# Altium project 200221 UCM R0.PrjPcb
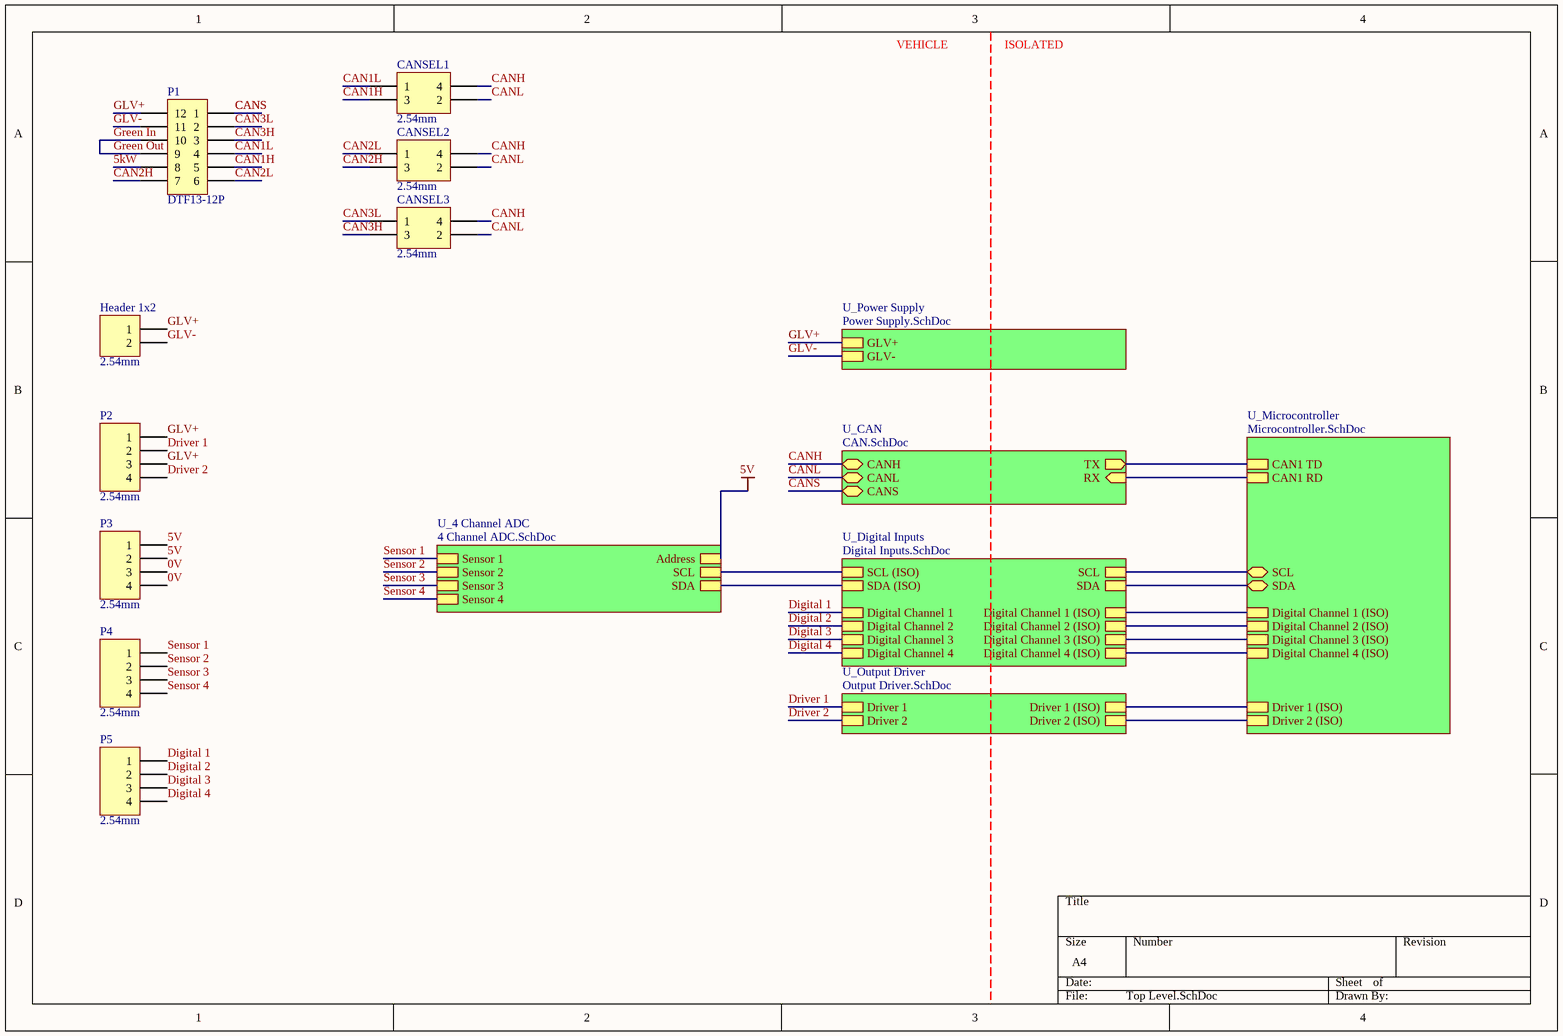
[diagram p0: Top Level.SchDoc]
8 sheets, 143 parts. Net scope: hierarchical (ports join the sheet entries above them; power ports are global).
Board file: PCB.PcbDoc
Sheets:
  Top Level.SchDoc
    U_4 Channel ADC = 4 Channel ADC.SchDoc
      U_Input Filter = Input Filter.SchDoc
      U_Input Filter = Input Filter.SchDoc
      U_Input Filter = Input Filter.SchDoc
      U_Input Filter = Input Filter.SchDoc
    U_CAN = CAN.SchDoc
    U_Output Driver = Output Driver.SchDoc
    U_Power Supply = Power Supply.SchDoc
    U_Microcontroller = Microcontroller.SchDoc
    U_Digital Inputs = Digital Inputs.SchDoc

## Sheet Top Level.SchDoc
size A4

### Parts
CANSEL1  2.54mm  [TH 2.54mm Header 2x2]
CANSEL2  2.54mm  [TH 2.54mm Header 2x2]
CANSEL3  2.54mm  [TH 2.54mm Header 2x2]
Header_1x2  2.54mm  [TH 5.08mm Header 1x2]
P1  DTF13-12P  [DTF13-12P]
P2  2.54mm  [TH 5.08mm Header 1x4]
P3  2.54mm  [TH 5.08mm Header 1x4]
P4  2.54mm  [TH 5.08mm Header 1x4]
P5  2.54mm  [TH 5.08mm Header 1x4]

### Sub-sheets
U_4 Channel ADC = 4 Channel ADC.SchDoc: Address, SCL, SDA, Sensor 1, Sensor 2, Sensor 3, Sensor 4
U_CAN = CAN.SchDoc: CANS (bidir), RX (in), CANL (bidir), CANH (bidir), TX (out)
U_Digital Inputs = Digital Inputs.SchDoc: Digital Channel 1, Digital Channel 2, Digital Channel 3, Digital Channel 4, Digital Channel 1 (ISO), Digital Channel 2 (ISO), Digital Channel 3 (ISO), Digital Channel 4 (ISO), SCL (ISO), SDA (ISO), SCL, SDA
U_Microcontroller = Microcontroller.SchDoc: CAN1 RD, CAN1 TD, SDA (bidir), SCL (bidir), Driver 1 (ISO), Driver 2 (ISO), Digital Channel 1 (ISO), Digital Channel 2 (ISO), Digital Channel 3 (ISO), Digital Channel 4 (ISO)
U_Output Driver = Output Driver.SchDoc: Driver 1, Driver 2, Driver 1 (ISO), Driver 2 (ISO)
U_Power Supply = Power Supply.SchDoc: GLV+, GLV-

### Nets
5V: P3.1 P3.2 ; sheet U_4 Channel ADC/Address
0V: P3.3 P3.4
5kW: P1.8
CAN1H: CANSEL1.3 P1.5
CAN1L: CANSEL1.1 P1.4
CAN2H: CANSEL2.3 P1.7
CAN2L: CANSEL2.1 P1.6
CAN3H: CANSEL3.3 P1.3
CAN3L: CANSEL3.1 P1.2
CANH: CANSEL1.4 CANSEL2.4 CANSEL3.4 ; sheet U_CAN/CANH
CANL: CANSEL1.2 CANSEL2.2 CANSEL3.2 ; sheet U_CAN/CANL
CANS: P1.1 ; sheet U_CAN/CANS
Digital 1: P5.1 ; sheet U_Digital Inputs/Digital Channel 1
Digital 2: P5.2 ; sheet U_Digital Inputs/Digital Channel 2
Digital 3: P5.3 ; sheet U_Digital Inputs/Digital Channel 3
Digital 4: P5.4 ; sheet U_Digital Inputs/Digital Channel 4
Driver 1: P2.2 ; sheet U_Output Driver/Driver 1
Driver 2: P2.4 ; sheet U_Output Driver/Driver 2
GLV+: Header_1x2.1 P1.12 P2.1 P2.3 ; sheet U_Power Supply/GLV+
GLV-: Header_1x2.2 P1.11 ; sheet U_Power Supply/GLV-
Green In: P1.9 P1.10  [also labelled Green Out]
Sensor 1: P4.1 ; sheet U_4 Channel ADC/Sensor 1
Sensor 2: P4.2 ; sheet U_4 Channel ADC/Sensor 2
Sensor 3: P4.3 ; sheet U_4 Channel ADC/Sensor 3
Sensor 4: P4.4 ; sheet U_4 Channel ADC/Sensor 4
NetCAN_RX_TP1_1: sheet U_CAN/RX, sheet U_Microcontroller/CAN1 RD
NetCAN_TX_TP1_1: sheet U_CAN/TX, sheet U_Microcontroller/CAN1 TD
NetR19_1: sheet U_Microcontroller/SCL, sheet U_Digital Inputs/SCL
NetR20_1: sheet U_Microcontroller/SDA, sheet U_Digital Inputs/SDA
NetR24_2: sheet U_Output Driver/Driver 1 (ISO), sheet U_Microcontroller/Driver 1 (ISO)
NetR27_2: sheet U_Output Driver/Driver 2 (ISO), sheet U_Microcontroller/Driver 2 (ISO)
NetR33_1: sheet U_4 Channel ADC/SCL, sheet U_Digital Inputs/SCL (ISO)
NetR34_1: sheet U_4 Channel ADC/SDA, sheet U_Digital Inputs/SDA (ISO)
NetU5_11: sheet U_Microcontroller/Digital Channel 4 (ISO), sheet U_Digital Inputs/Digital Channel 4 (ISO)
NetU5_12: sheet U_Microcontroller/Digital Channel 3 (ISO), sheet U_Digital Inputs/Digital Channel 3 (ISO)
NetU5_13: sheet U_Microcontroller/Digital Channel 2 (ISO), sheet U_Digital Inputs/Digital Channel 2 (ISO)
NetU5_14: sheet U_Microcontroller/Digital Channel 1 (ISO), sheet U_Digital Inputs/Digital Channel 1 (ISO)

### Notes on the sheet
- VEHICLE
- ISOLATED

### Library data of the parts
CANSEL1-CANSEL3 = TH 2.54mm Header 2x2: Positions: 4; Angle: 0; Flange: No; Contact: NA; Part Number: TH 2.54mm Header 2x2; Pitch: 2.54mm; Row Spacing: 2.54mm
Header_1x2 = TH 5.08mm Header 1x2: Positions: 2; Row Spacing: 5.08mm; Angle: 0; Flange: No; Contact: NA; Part Number: TH 5.08mm Header 1x2; Pitch: 2.54mm
P1 = DTF13-12P[[/\]]DTF13-12P: Positions: 12; Pitch: 4.45mm; Angle: 90; Flange: No; Contact: Copper Alloy; Part Number: DTF13-12P; Row Spacing: 4.45mm; Digikey Part Number: 1734-1861-ND; Digikey Link: https://www.digikey.com.au/product-detail/en/te-connectivity-deutsch-connectors/DTF13-12PA/1734-1861-ND/9744662
P2-P5 = TH 5.08mm Header 1x4: Positions: 4; Row Spacing: 5.08mm; Angle: 0; Flange: No; Contact: NA; Part Number: TH 5.08mm Header 1x4; Pitch: 2.54mm

## Sheet 4 Channel ADC.SchDoc
size A4
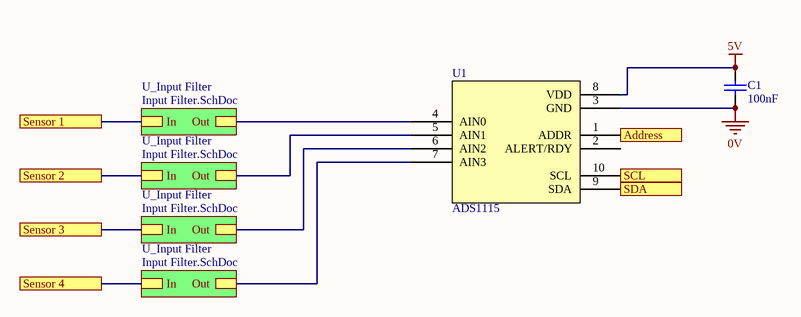
[diagram p1: 4 Channel ADC.SchDoc]

### Parts
C1  100nF  [0805]
U1  ADS1115  [TI 10-VSSOP]

### Sub-sheets
U_Input Filter = Input Filter.SchDoc: In, Out
U_Input Filter = Input Filter.SchDoc: In, Out
U_Input Filter = Input Filter.SchDoc: In, Out
U_Input Filter = Input Filter.SchDoc: In, Out

### Ports
Address, SCL, SDA, Sensor 1, Sensor 2, Sensor 3, Sensor 4

### Nets
0V: C1.1 U1.3(GND)
5V: C1.2 U1.1(ADDR) U1.8(VDD) ; port Address
Sensor 1: port Sensor 1, sheet U_Input Filter/In
Sensor 2: port Sensor 2, sheet U_Input Filter/In
Sensor 3: port Sensor 3, sheet U_Input Filter/In
Sensor 4: port Sensor 4, sheet U_Input Filter/In
NetC17_U_Input_Filter1_2: U1.7(AIN3) ; sheet U_Input Filter/Out
NetC17_U_Input_Filter2_2: U1.6(AIN2) ; sheet U_Input Filter/Out
NetC17_U_Input_Filter3_2: U1.5(AIN1) ; sheet U_Input Filter/Out
NetC17_U_Input_Filter4_2: U1.4(AIN0) ; sheet U_Input Filter/Out
NetR33_1: U1.10(SCL) ; port SCL
NetR34_1: U1.9(SDA) ; port SDA

Not connected (* = marked no-connect by the designer): U1 2(ALERT/RDY)

### Library data of the parts
C1 = GCM21BR71E104KA37L: Manufacturer: muRata; Tolerance: 10%; Material: X7R; Rated Voltage: 25V; Part Number: GCM21BR71E104KA37L; Value: 100nF
U1 = ADS1115: 16 Bit Analog to Digital Converter 2, 4 Input 1 Sigma-Delta 10-VSSOP; Manufacturer: Texas Instruments; Part Number: ADS1115; Digikey Part Number: 296-38849-1-ND; Digikey Link: https://www.digikey.com/product-detail/en/texas-instruments/ADS1115IDGSR/296-38849-1-ND/5142969

## Sheet Input Filter.SchDoc
size A4
Used 4 times, as channels U_4 Channel ADC/U_Input Filter, U_4 Channel ADC/U_Input Filter, U_4 Channel ADC/U_Input Filter, U_4 Channel ADC/U_Input Filter. Parts and nets are listed once, with the designators drawn on the sheet.
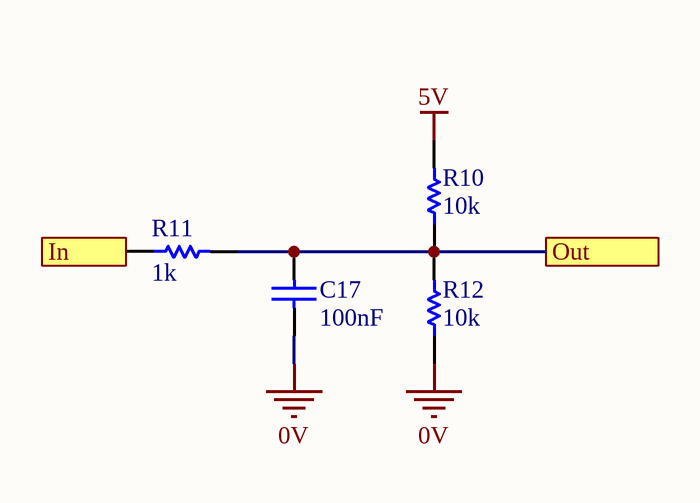
[diagram p2: Input Filter.SchDoc]

### Parts
C17  100nF  [0805]
R10  10k  [0805]
R11  1k  [0805]
R12  10k  [0805]

### Ports
In, Out

### Nets
0V: C17.1 R12.1
5V: R10.2
In: R11.1 ; port In
Out: C17.2 R10.1 R11.2 R12.2 ; port Out

### Channels
U_4 Channel ADC/U_Input Filter: designators end in _U_Input_Filter4; ports In=Sensor 1 Out=NetC17_U_Input_Filter4_2
U_4 Channel ADC/U_Input Filter: designators end in _U_Input_Filter3; ports In=Sensor 2 Out=NetC17_U_Input_Filter3_2
U_4 Channel ADC/U_Input Filter: designators end in _U_Input_Filter2; ports In=Sensor 3 Out=NetC17_U_Input_Filter2_2
U_4 Channel ADC/U_Input Filter: designators end in _U_Input_Filter1; ports In=Sensor 4 Out=NetC17_U_Input_Filter1_2

### Library data of the parts
C17 = GCM21BR71E104KA37L: as C1 on sheet 4 Channel ADC; Part Number: GCM21BR71E104KA37L; Value: 100nF
R10 R12 = RC0805FR0710KL: Manufacturer: YAGEO; Tolerance: 0.01; Rated Voltage: 0.125W; Part Number: RC0805FR0710KL; Value: 10k; Material: FR-07
R11 = RC0805FR071KL: Manufacturer: YAGEO; Tolerance: 0.01; Rated Voltage: 0.125W; Part Number: RC0805FR071KL; Value: 1k; Material: FR-07

## Sheet CAN.SchDoc
size A4
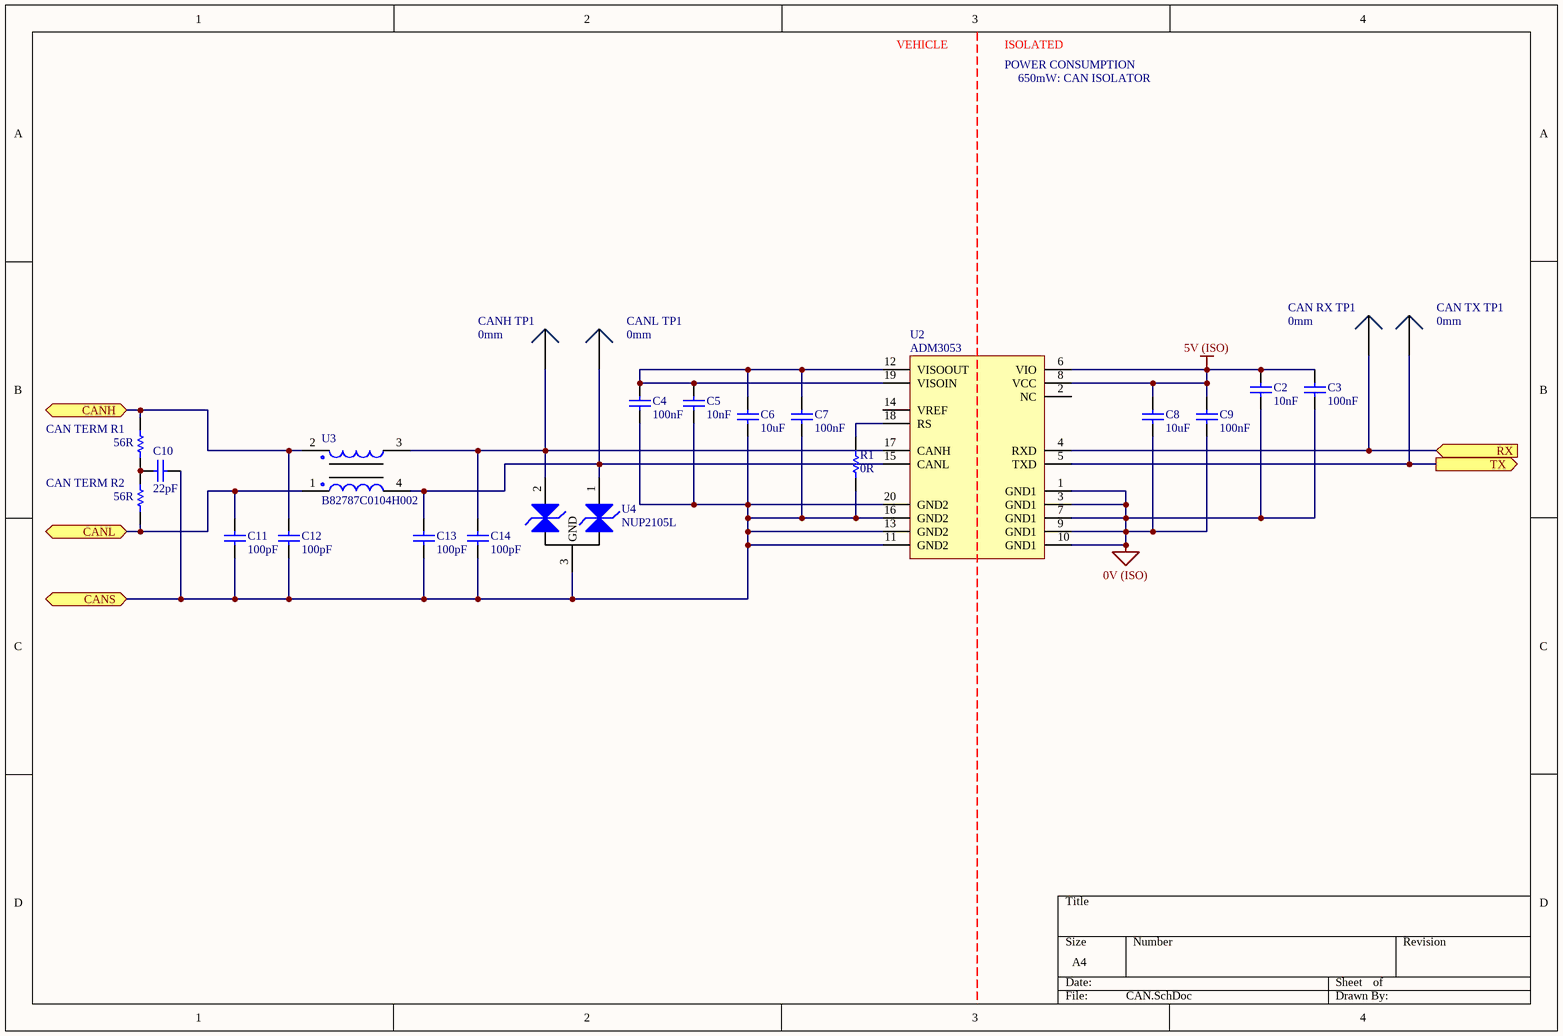
[diagram p3: CAN.SchDoc]

### Parts
C2  10nF  [1206]
C3  100nF  [0805]
C4  100nF  [0805]
C5  10nF  [1206]
C6  10uF  [0805]
C7  100nF  [0805]
C8  10uF  [0805]
C9  100nF  [0805]
C10  22pF  [0805]
C11  100pF  [0805]
C12  100pF  [0805]
C13  100pF  [0805]
C14  100pF  [0805]
CAN_RX_TP1  0mm  [SMD Test Point]
CAN_TERM_R1  56R  [0805]
CAN_TERM_R2  56R  [0805]
CAN_TX_TP1  0mm  [SMD Test Point]
CANH_TP1  0mm  [SMD Test Point]
CANL_TP1  0mm  [SMD Test Point]
R1  0R  [0805]
U2  ADM3053  [AD SOIC-W 20]
U3  B82787C0104H002  [TDK 4-PC Pad]
U4  NUP2105L  [ON SOT-23]

### Ports
CANH (bidir), CANL (bidir), CANS (bidir), RX (in), TX (out)

### Nets
0V (ISO): C2.1 C3.1 C8.1 C9.1 U2.1(GND1) U2.3(GND1) U2.7(GND1) U2.9(GND1) U2.10(GND1)
5V (ISO): C2.2 C3.2 C8.2 C9.2 U2.6(VIO) U2.8(VCC)
CANH: C12.2 CAN_TERM_R1.2 U3.2 ; port CANH
CANL: C11.2 CAN_TERM_R2.1 U3.1 ; port CANL
CANS: C4.1 C5.1 C6.1 C7.1 C10.1 C11.1 C12.1 C13.1 C14.1 R1.1 U2.11(GND2) U2.13(GND2) U2.16(GND2) U2.20(GND2) U4.3(GND) ; port CANS
NetC4_2: C4.2 C5.2 C6.2 C7.2 U2.12(VISOOUT) U2.19(VISOIN)
NetC10_2: C10.2 CAN_TERM_R1.1 CAN_TERM_R2.2
NetC13_2: C13.2 CANL_TP1.1 U2.15(CANL) U3.4 U4.1(CAN_H)
NetC14_2: C14.2 CANH_TP1.1 U2.17(CANH) U3.3 U4.2(CAN_L)
NetCAN_RX_TP1_1: CAN_RX_TP1.1 U2.4(RXD) ; port RX
NetCAN_TX_TP1_1: CAN_TX_TP1.1 U2.5(TXD) ; port TX
NetR1_2: R1.2 U2.18(RS)

Not connected (* = marked no-connect by the designer): U2 2(NC) 14(VREF)

### Notes on the sheet
- VEHICLE
- ISOLATED
- POWER CONSUMPTION
- 650mW: CAN ISOLATOR

### Library data of the parts
C2 C5 = GCM3195C2A103JA16D: Manufacturer: muRata; Tolerance: 5%; Material: Ceramic; Rated Voltage: 100V; Part Number: GCM3195C2A103JA16D; Value: 10nF; Digikey Part Number: 490-4978-2-ND
C3 C4 C7 C9 = GCM21BR71E104KA37L: as C1 on sheet 4 Channel ADC; Part Number: GCM21BR71E104KA37L; Value: 100nF
C6 C8 = GRM21BR6YA106KE43L: Manufacturer: muRata; Tolerance: 10%; Material: X5R; Rated Voltage: 50V; Part Number: GRM21BR6YA106KE43L; Value: 10uF; Digikey Part Number: 490-10514-6-ND
C10 = GCM21B5C1H220JA37L: Manufacturer: muRata; Tolerance: 5%; Material: C0G; Rated Voltage: 50V; Part Number: GCM21B5C1H220JA37L; Value: 22pF
C11-C14 = GCM21B5C1H101JA37L: Manufacturer: muRata; Tolerance: 5%; Material: C0G; Rated Voltage: 50V; Part Number: GCM21B5C1H101JA37L; Value: 100pF
CAN_RX_TP1 CAN_TX_TP1 CANH_TP1 CANL_TP1 = SMD Test Point: Positions: 1; Row Spacing: 0; Flange: No; Contact: NA; Part Number: SMD Test Point; Pitch: 0mm; Angle: 0
CAN_TERM_R1 CAN_TERM_R2 = RC0805FR0756RL: Manufacturer: YAGEO; Tolerance: 0.01; Rated Voltage: 0.125W; Part Number: RC0805FR0756RL; Value: 56R; Material: FR-07
R1 = RC0805FR070RL: Manufacturer: YAGEO; Tolerance: 0.01; Rated Voltage: 0.125W; Part Number: RC0805FR070RL; Value: 0R; Material: FR-07
U2 = ADM3053: Isolated CAN Transceiver; Manufacturer: Analogue Devices; Part Number: ADM3053; Digikey Part Number: ADM3053BRWZ-ND; Digikey Link: https://www.digikey.com/product-detail/en/analog-devices-inc/ADM3053BRWZ/ADM3053BRWZ-ND/2709332
U3 = B82787C0104H002: 100µH @ 100kHz 2 Line Common Mode Choke Surface Mount 5.8 kOhms @ 10MHz 150mA DCR 2Ohm; Manufacturer: EPCOS (TDK); Part Number: B82787C0104H002; Inductance: 100µH @ 100kHz; Impedence: 5.8 kOhms @ 10MHz; Material: Wirewound; Rated Current: 150mA; Digikey Part Number: 495-4598-1-ND; Digikey Link: https://www.digikey.com/product-detail/en/epcos-tdk/B82787C0104H002/495-4598-2-ND/3680998
U4 = NUP2105L: Dual Line CAN Bus Protector; Manufacturer: ON Semiconductor; Part Number: NUP2105L; Digikey Part Number: NUP2105LT1GOSCT-ND; Digikey Link: https://www.digikey.com/product-detail/en/on-semiconductor/NUP2105LT1G/NUP2105LT1GOSCT-ND/1485001

## Sheet Output Driver.SchDoc
size A4
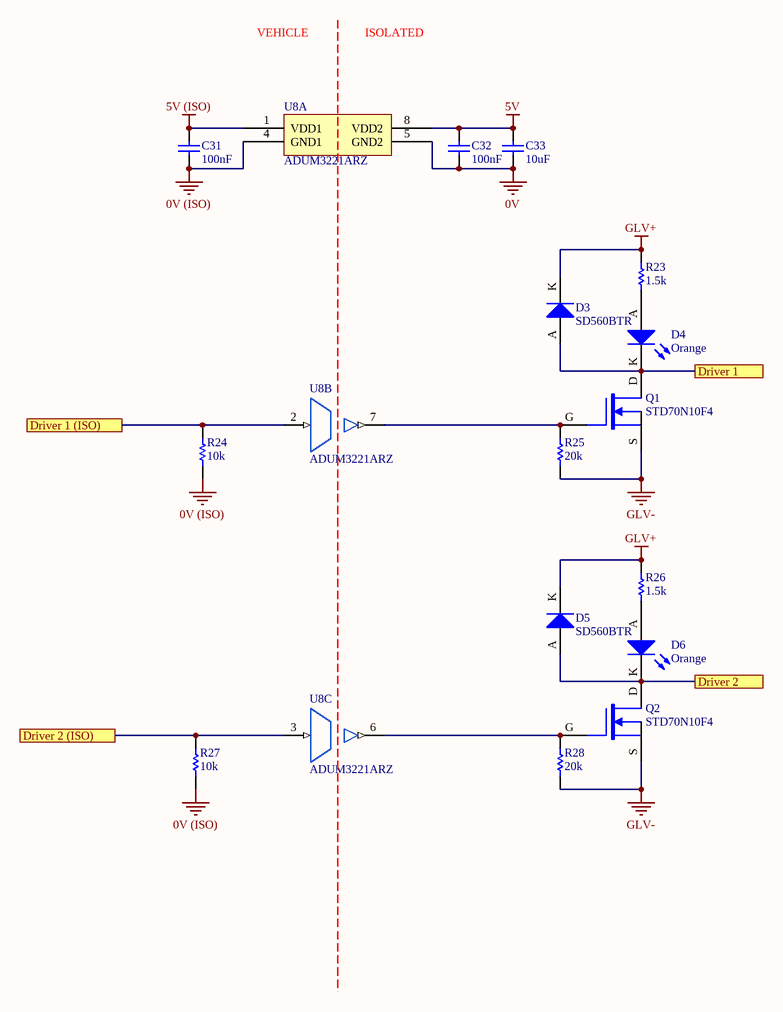
[diagram p4: Output Driver.SchDoc]

### Parts
C31  100nF  [0805]
C32  100nF  [0805]
C33  10uF  [0805]
D3  SD560BTR  [SMB Diode]
D4  Orange  [0805 LED]
D5  SD560BTR  [SMB Diode]
D6  Orange  [0805 LED]
Q1  STD70N10F4  [SOT-343_N]
Q2  STD70N10F4  [SOT-343_N]
R23  1.5k  [0805]
R24  10k  [0805]
R25  20k  [0805]
R26  1.5k  [0805]
R27  10k  [0805]
R28  20k  [0805]
U8  ADUM3221ARZ  [AD 8-SOIC]  (parts A,B,C of 3)

### Ports
Driver 1, Driver 1 (ISO), Driver 2, Driver 2 (ISO)

### Nets
0V: C32.1 C33.1 U8.5(GND2)
0V (ISO): C31.1 R24.1 R27.1 U8.4(GND1)
5V: C32.2 C33.2 U8.8(VDD2)
5V (ISO): C31.2 U8.1(VDD1)
GLV+: D3.K D5.K R23.2 R26.2
GLV-: Q1.S Q2.S R25.1 R28.1
Driver 1: D3.A D4.K Q1.D ; port Driver 1
Driver 2: D5.A D6.K Q2.D ; port Driver 2
NetD4_A: D4.A R23.1
NetD6_A: D6.A R26.1
NetQ1_G: Q1.G R25.2 U8.7(VOA)
NetQ2_G: Q2.G R28.2 U8.6(VOA)
NetR24_2: R24.2 U8.2(VIA) ; port Driver 1 (ISO)
NetR27_2: R27.2 U8.3(VIA) ; port Driver 2 (ISO)

### Notes on the sheet
- VEHICLE
- ISOLATED

### Library data of the parts
C31 C32 = GCM21BR71E104KA37L: as C1 on sheet 4 Channel ADC; Part Number: GCM21BR71E104KA37L; Value: 100nF
C33 = GRM21BR6YA106KE43L: as C6 on sheet CAN; Part Number: GRM21BR6YA106KE43L; Value: 10uF; Digikey Part Number: 490-10514-6-ND
D3 D5 = SD560BTR: 1.2V_F 600V 5A SMB; Manufacturer: SMC Diode Solutions; Part Number: SD560BTR; Digikey Part Number: 1655-1530-2-ND; Digikey Link: https://www.digikey.com/product-detail/en/smc-diode-solutions/SD560BTR/1655-1530-2-ND/6022620
D4 D6 = SML-211DTT86: Orange LED Indication - Discrete 1.75V 0805 (2012 Metric); Manufacturer: ROHM Semiconductor; Part Number: SML-211DTT86; Colour: Orange; Digikey Part Number: 511-1291-1-ND; Digikey Link: https://www.digikey.com/product-detail/en/rohm-semiconductor/SML-211DTT86/511-1291-1-ND/637104
Q1 Q2 = STD70N10F4: N-Channel 100V 60A (Tc) 125W (Tc) Surface Mount DPAK; Manufacturer: STMicroelectronics; Published: 24-Mar-1999; LatestRevisionDate: 29-May-2009; LatestRevisionNote: IPC-7351 Footprint Added.; PackageVersion: Sep-2000; PackageReference: SOT-343; Publisher: Altium Limited; PackageDescription: 4-Pin SOT-343 Package 1.3 mm Pitch, 2.1 mm Lead Span; Part Number: STD70N10F4; Digikey Part Number: 497-8806-2-ND; Digikey Link: https://www.digikey.com/product-detail/en/stmicroelectronics/STD70N10F4/497-8806-2-ND/2035599
R23 R26 = RC0805FR071K5L: Manufacturer: YAGEO; Tolerance: 0.01; Rated Voltage: 0.125W; Part Number: RC0805FR071K5L; Value: 1.5k; Material: FR-07
R24 R27 = RC0805FR0710KL: as R10 on sheet Input Filter; Part Number: RC0805FR0710KL; Value: 10k; Material: FR-07
R25 R28 = RC0805FR0720KL: Manufacturer: YAGEO; Tolerance: 0.01; Rated Voltage: 0.125W; Part Number: RC0805FR0720KL; Value: 20k; Material: FR-07
U8 = ADUM3221ARZ: 4A Gate Driver Magnetic Coupling 2500Vrms 2 Channel 8-SOIC; Manufacturer: Analog Devices; Part Number: ADUM3221ARZ; Digikey Part Number: ADUM3221ARZ-ND; Digikey Link: https://www.digikey.com/product-detail/en/analog-devices-inc/ADUM3221ARZ/ADUM3221ARZ-ND/2616333

## Sheet Power Supply.SchDoc
size A4
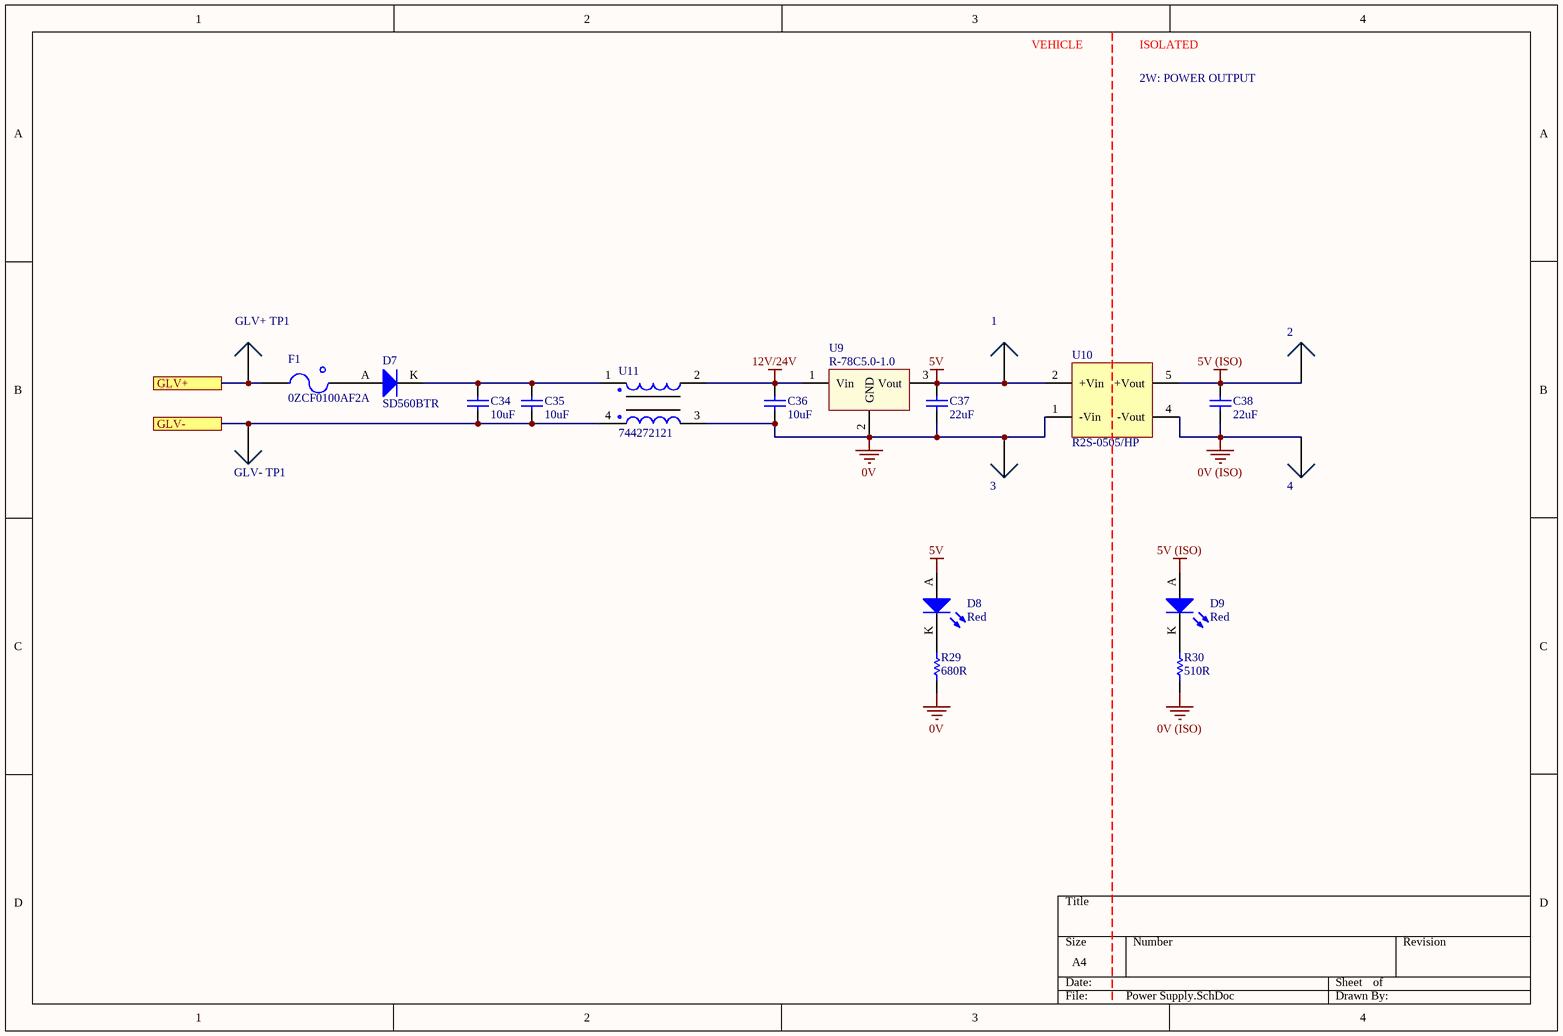
[diagram p5: Power Supply.SchDoc]

### Parts
1  0mm  [SMD Test Point]  (value not drawn)
2  0mm  [SMD Test Point]  (value not drawn)
3  0mm  [SMD Test Point]  (value not drawn)
4  0mm  [SMD Test Point]  (value not drawn)
C34  10uF  [0805]
C35  10uF  [0805]
C36  10uF  [0805]
C37  22uF  [1206]
C38  22uF  [1206]
D7  SD560BTR  [SMB Diode]
D8  Red  [0805 LED]
D9  Red  [0805 LED]
F1  0ZCF0100AF2A  [2920]
GLV+_TP1  0mm  [SMD Test Point]  (value not drawn)
GLV-_TP1  0mm  [SMD Test Point]  (value not drawn)
R29  680R  [0805]
R30  510R  [0805]
U9  R-78C5.0-1.0  [RECOM 3-SIP]
U10  R2S-0505/HP  [RECOM 8-SMD (5 Pin)]
U11  744272121  [INDC3216]

### Ports
GLV+, GLV-

### Nets
0V: 3.1 C36.1 C37.1 R29.1 U9.2(GND) U10.1(-Vin) U11.3
0V (ISO): 4.1 C38.1 R30.1 U10.4(-Vout)
5V: 1.1 C37.2 D8.A U9.3(Vout) U10.2(+Vin)
5V (ISO): 2.1 C38.2 D9.A U10.5(+Vout)
12V/24V: C36.2 U9.1(Vin) U11.2
GLV+: F1.1 GLV+_TP1.1 ; port GLV+
GLV-: C34.1 C35.1 GLV-_TP1.1 U11.4 ; port GLV-
NetC34_2: C34.2 C35.2 D7.K U11.1
NetD7_A: D7.A F1.2
NetD8_K: D8.K R29.2
NetD9_K: D9.K R30.2

### Notes on the sheet
- VEHICLE
- ISOLATED
- 2W: POWER OUTPUT

### Library data of the parts
1-4 GLV+_TP1 GLV-_TP1 = SMD Test Point: as CAN_RX_TP1 on sheet CAN; Part Number: SMD Test Point; Pitch: 0mm; Angle: 0
C34-C36 = GRM21BR6YA106KE43L: as C6 on sheet CAN; Part Number: GRM21BR6YA106KE43L; Value: 10uF; Digikey Part Number: 490-10514-6-ND
C37 C38 = CC1206MKX5R7BB226: Manufacturer: YAGEO; Tolerance: 20%; Material: Ceramic; Rated Voltage: 16V; Part Number: CC1206MKX5R7BB226; Value: 22uF; Digikey Part Number: 311-1997-2-ND
D7 = SD560BTR: as D3 on sheet Output Driver; Part Number: SD560BTR; Digikey Part Number: 1655-1530-2-ND; Digikey Link: https://www.digikey.com/product-detail/en/smc-diode-solutions/SD560BTR/1655-1530-2-ND/6022620
D8 D9 = SML-210LTT86: Red LED Indication - Discrete 1.75V 0805 (2012 Metric); Manufacturer: ROHM Semiconductor; Part Number: SML-210LTT86; Colour: Red; Digikey Part Number: 511-1286-1-ND; Digikey Link: https://www.digikey.com/product-detail/en/rohm-semiconductor/SML-210LTT86/511-1286-1-ND/637099
F1 = 0ZCF0100AF2A: PTC RESET FUSE 60V 1A 292; Manufacturer: Littelfuse Inc.; Part Number: 0ZCF0100AF2A; Digikey Part Number: 507-2070-1-ND; Digikey Link: https://www.digikey.com/product-detail/en/bel-fuse-inc/0ZCF0100AF2A/507-2070-1-ND/6210547
R29 = RC0805FR07680RL: Manufacturer: YAGEO; Tolerance: 0.01; Rated Voltage: 0.125W; Part Number: RC0805FR07680RL; Value: 680R; Material: FR-07
R30 = RC0805FR07510RL: Manufacturer: YAGEO; Tolerance: 0.01; Rated Voltage: 0.125W; Part Number: RC0805FR07510RL; Value: 510R; Material: FR-07
U9 = R-78C5.0-1.0: CONV DC/DC 1A 5V OUT SIP VERT; Manufacturer: Recom; Isolation: Non-Isolated; Part Number: R-78C5.0-1.0; Digikey Part Number: 945-1395-5-ND; Digikey Link: https://www.digikey.com.au/product-detail/en/recom-power/R-78C5.0-1.0/945-1395-5-ND/2652148
U10 = R2S-0505/HP: Isolated Module DC DC Converter 1 Output 3.3V 606mA 4.5V - 5.5V Input; Manufacturer: Recom; Output Voltage: 5V; Output Power: 2W; Efficiency: 0.85; Part Number: R2S-0505/HP; Input Voltage: 4.5V-5.5V; Isolation: Isolated; Digikey Part Number: 945-1764-5-ND; Digikey Link: https://www.digikey.com/product-detail/en/recom-power/R2S-0505-HP/945-1764-5-ND/2302761
U11 = 744272121: 120µH @ 100kHz 2 Line Common Mode Choke Surface Mount 460 Ohms @ 30MHz 2.5A DCR 25mOhm; Manufacturer: Wurth Electronics Inc; Inductance: 120uH @ 100kHz; Part Number: 744272121; Impedence: 460 Ohms @ 30MHz; Material: Wirewound; Rated Current: 2.5A; Digikey Part Number: 732-1489-1-ND; Digikey Link: https://www.digikey.com/product-detail/en/w-rth-elektronik/744272121/732-1489-1-ND/1639501

## Sheet Microcontroller.SchDoc
size A3
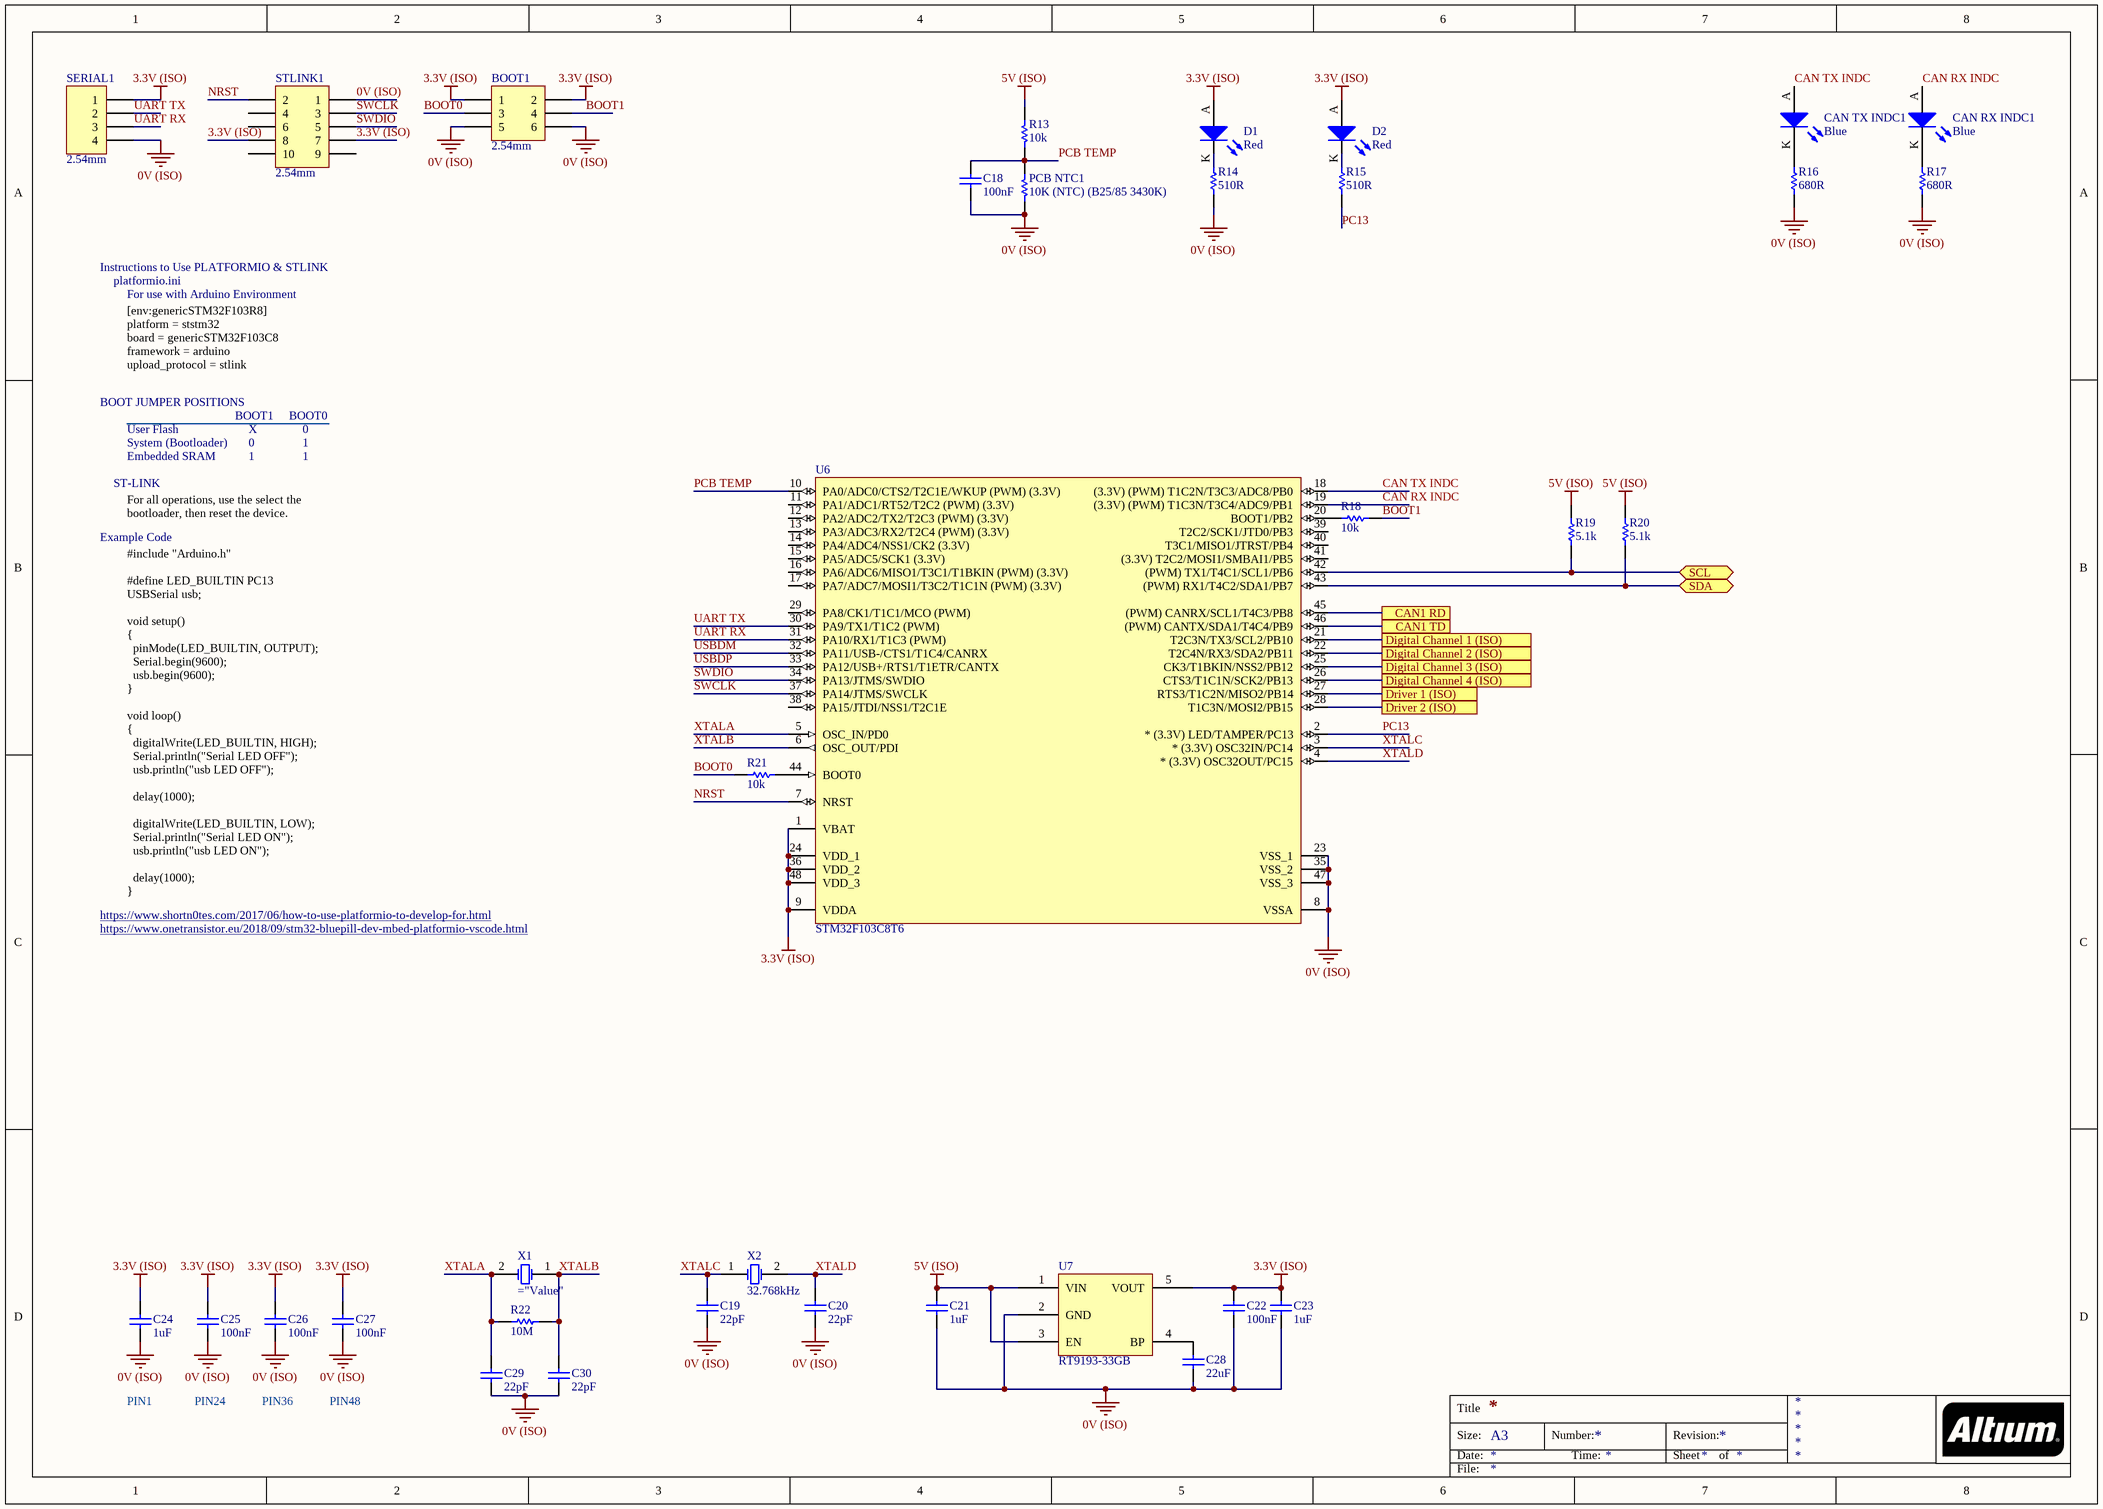
[diagram p6: Microcontroller.SchDoc]

### Parts
BOOT1  2.54mm  [TH 2.54mm Header 2x3]
C18  100nF  [0805]
C19  22pF  [0805]
C20  22pF  [0805]
C21  1uF  [0805]
C22  100nF  [0805]
C23  1uF  [0805]
C24  1uF  [0805]
C25  100nF  [0805]
C26  100nF  [0805]
C27  100nF  [0805]
C28  22uF  [0805]
C29  22pF  [0805]
C30  22pF  [0805]
CAN_RX_INDC1  Blue  [0805 LED]
CAN_TX_INDC1  Blue  [0805 LED]
D1  Red  [0805 LED]
D2  Red  [0805 LED]
PCB_NTC1  10K (NTC) (B25/85 3430K)  [0805]
R13  10k  [0805]
R14  510R  [0805]
R15  510R  [0805]
R16  680R  [0805]
R17  680R  [0805]
R18  10k  [0805]
R19  5.1k  [0805]
R20  5.1k  [0805]
R21  10k  [0805]
R22  10M  [0805]
SERIAL1  2.54mm  [TH 2.54mm Header 1x4]
STLINK1  2.54mm  [TH 2.54mm Header 2x5]
U6  STM32F103C8T6  [STM 48-LQFP]
U7  RT9193-33GB  [RICHTEK SOT-23-5]
X1  (no value)  [Abracon HC-49/US]
X2  32.768kHz  [EPSON 2-SMD]

### Ports
CAN1 RD, CAN1 TD, Digital Channel 1 (ISO), Digital Channel 2 (ISO), Digital Channel 3 (ISO), Digital Channel 4 (ISO), Driver 1 (ISO), Driver 2 (ISO), SCL (bidir), SDA (bidir)

### Nets
0V (ISO): BOOT1.5 BOOT1.6 C18.1 C19.1 C20.1 C21.1 C22.1 C23.1 C24.1 C25.1 C26.1 C27.1 C28.1 C29.1 C30.1 PCB_NTC1.1 R14.1 R16.1 R17.1 SERIAL1.4 STLINK1.1 U6.8(VSSA) U6.23(VSS_1) U6.35(VSS_2) U6.47(VSS_3) U7.2(GND)
3.3V (ISO): BOOT1.1 BOOT1.2 C22.2 C23.2 C24.2 C25.2 C26.2 C27.2 D1.A D2.A SERIAL1.1 STLINK1.7 STLINK1.8 U6.1(VBAT) U6.9(VDDA) U6.24(VDD_1) U6.36(VDD_2) U6.48(VDD_3) U7.5(VOUT)
5V (ISO): C21.2 R13.2 R19.2 R20.2 U7.1(VIN) U7.3(EN)
BOOT0: BOOT1.3 R21.1
BOOT1: BOOT1.4 R18.2
CAN RX INDC: CAN_RX_INDC1.A U6.19((3.3V)_(PWM)_T1C3N/T3C4/ADC9/PB1)
CAN TX INDC: CAN_TX_INDC1.A U6.18((3.3V)_(PWM)_T1C2N/T3C3/ADC8/PB0)
NRST: STLINK1.2 U6.7(NRST)
PC13: R15.1 U6.2(*_(3.3V)_LED/TAMPER/PC13)
PCB TEMP: C18.2 PCB_NTC1.2 R13.1 U6.10(PA0/ADC0/CTS2/T2C1E/WKUP_(PWM)_(3.3V))
SWCLK: STLINK1.3 U6.37(PA14/JTMS/SWCLK)
SWDIO: STLINK1.5 U6.34(PA13/JTMS/SWDIO)
UART RX: SERIAL1.3 U6.31(PA10/RX1/T1C3_(PWM))
UART TX: SERIAL1.2 U6.30(PA9/TX1/T1C2_(PWM))
USBDM: U6.32(PA11/USB-/CTS1/T1C4/CANRX)
USBDP: U6.33(PA12/USB+/RTS1/T1ETR/CANTX)
XTALA: C29.2 R22.2 U6.5(OSC_IN/PD0) X1.2(OSC2)
XTALB: C30.2 R22.1 U6.6(OSC_OUT/PDI) X1.1(OSC1)
XTALC: C19.2 U6.3(*_(3.3V)_OSC32IN/PC14) X2.1(OSC1)
XTALD: C20.2 U6.4(*_(3.3V)_OSC32OUT/PC15) X2.2(OSC2)
NetC28_2: C28.2 U7.4(BP)
NetCAN_RX_INDC1_K: CAN_RX_INDC1.K R17.2
NetCAN_RX_TP1_1: U6.45((PWM)_CANRX/SCL1/T4C3/PB8) ; port CAN1 RD
NetCAN_TX_INDC1_K: CAN_TX_INDC1.K R16.2
NetCAN_TX_TP1_1: U6.46((PWM)_CANTX/SDA1/T4C4/PB9) ; port CAN1 TD
NetD1_K: D1.K R14.2
NetD2_K: D2.K R15.2
NetR18_1: R18.1 U6.20(BOOT1/PB2)
NetR19_1: R19.1 U6.42((PWM)_TX1/T4C1/SCL1/PB6) ; port SCL
NetR20_1: R20.1 U6.43((PWM)_RX1/T4C2/SDA1/PB7) ; port SDA
NetR21_2: R21.2 U6.44(BOOT0)
NetR24_2: U6.27(RTS3/T1C2N/MISO2/PB14) ; port Driver 1 (ISO)
NetR27_2: U6.28(T1C3N/MOSI2/PB15) ; port Driver 2 (ISO)
NetU5_11: U6.26(CTS3/T1C1N/SCK2/PB13) ; port Digital Channel 4 (ISO)
NetU5_12: U6.25(CK3/T1BKIN/NSS2/PB12) ; port Digital Channel 3 (ISO)
NetU5_13: U6.22(T2C4N/RX3/SDA2/PB11) ; port Digital Channel 2 (ISO)
NetU5_14: U6.21(T2C3N/TX3/SCL2/PB10) ; port Digital Channel 1 (ISO)

Not connected (* = marked no-connect by the designer): STLINK1 4 6 9 10; U6 11(PA1/ADC1/RT52/T2C2_(PWM)_(3.3V)) 12(PA2/ADC2/TX2/T2C3_(PWM)_(3.3V)) 13(PA3/ADC3/RX2/T2C4_(PWM)_(3.3V)) 14(PA4/ADC4/NSS1/CK2_(3.3V)) 15(PA5/ADC5/SCK1_(3.3V)) 16(PA6/ADC6/MISO1/T3C1/T1BKIN_(PWM)_(3.3V)) 17(PA7/ADC7/MOSI1/T3C2/T1C1N_(PWM)_(3.3V)) 29(PA8/CK1/T1C1/MCO_(PWM)) 38(PA15/JTDI/NSS1/T2C1E) 39(T2C2/SCK1/JTD0/PB3) 40(T3C1/MISO1/JTRST/PB4) 41((3.3V)_T2C2/MOSI1/SMBAI1/PB5)

### Notes on the sheet
- Instructions to Use PLATFORMIO & STLINK
- platformio.ini
- For use with Arduino Environment
- BOOT JUMPER POSITIONS
- [env:genericSTM32F103R8]
  platform = ststm32
  board = genericSTM32F103C8
  framework = arduino
  upload_protocol = stlink
- User Flash
- System (Bootloader)
- BOOT1
- X
- 0
- BOOT0
- 1
- ST-LINK
- Embedded SRAM
- For all operations, use the select the bootloader, then reset the device.
- Example Code
- https://www.shortn0tes.com/2017/06/how-to-use-platformio-to-develop-for.html
- #include "Arduino.h"
  #define LED_BUILTIN PC13
  USBSerial usb;
  void setup()
  {
  pinMode(LED_BUILTIN, OUTPUT);
  Serial.begin(9600);
  usb.begin(9600);
  }
  void loop()
  {
  digitalWrite(LED_BUILTIN, HIGH);
  Serial.println("Serial LED OFF");
  usb.println("usb LED OFF");
  delay(1000);
  digitalWrite(LED_BUILTIN, LOW);
  Serial.println("Serial LED ON");
  usb.println("usb LED ON");
  delay(1000);
  }
- https://www.onetransistor.eu/2018/09/stm32-bluepill-dev-mbed-platformio-vscode.html
- PIN1
- PIN24
- PIN36
- PIN48
- Title
- Size:
- Date:
- A3
- Number:
- Time:
- Revision:
- Sheet
- of
- File:

### Library data of the parts
BOOT1 = TH 2.54mm Header 2x3: Positions: 6; Angle: 0; Flange: No; Contact: NA; Part Number: TH 2.54mm Header 2x3; Pitch: 2.54mm; Row Spacing: 2.54mm
C18 C22 C25-C27 = GCM21BR71E104KA37L: as C1 on sheet 4 Channel ADC; Part Number: GCM21BR71E104KA37L; Value: 100nF
C19 C20 C29 C30 = GCM21B5C1H220JA37L: as C10 on sheet CAN; Part Number: GCM21B5C1H220JA37L; Value: 22pF
C21 C23 C24 = AC0805KKX7R8BB105: Manufacturer: YAGEO; Tolerance: 10%; Material: X7R; Rated Voltage: 25V; Part Number: AC0805KKX7R8BB105; Value: 1uF
C28 = GRM21BR61A226ME51L: Manufacturer: muRata; Tolerance: 20%; Material: X5R; Rated Voltage: 10V; Part Number: GRM21BR61A226ME51L; Value: 22uF; Digikey Part Number: 490-10511-1-ND
CAN_RX_INDC1 CAN_TX_INDC1 = SML-MN2BCTT86C: LED BLUE CLEAR 2012 SMD; Manufacturer: ROHM Semiconductor; Part Number: SML-MN2BCTT86C; Colour: Blue; Digikey Part Number: 846-1207-1-ND; Digikey Link: https://www.digikey.com/product-detail/en/rohm-semiconductor/SMLMN2BCTT86C/846-1207-1-ND/6057239
D1 D2 = SML-210LTT86: as D8 on sheet Power Supply; Part Number: SML-210LTT86; Colour: Red; Digikey Part Number: 511-1286-1-ND; Digikey Link: https://www.digikey.com/product-detail/en/rohm-semiconductor/SML-210LTT86/511-1286-1-ND/637099
PCB_NTC1 = NTCS0805E3103FLT: Manufacturer: Vishay Beyschlag; Tolerance: 0.01; Rated Voltage: 210mW; Part Number: NTCS0805E3103FLT; Value: 10K (NTC) (B25/85 3430K); Digikey Part Number: BC2733CT-ND
R13 R18 R21 = RC0805FR0710KL: as R10 on sheet Input Filter; Part Number: RC0805FR0710KL; Value: 10k; Material: FR-07
R14 R15 = RC0805FR07510RL: as R30 on sheet Power Supply; Part Number: RC0805FR07510RL; Value: 510R; Material: FR-07
R16 R17 = RC0805FR07680RL: as R29 on sheet Power Supply; Part Number: RC0805FR07680RL; Value: 680R; Material: FR-07
R19 R20 = RC0805FR075K1L: Manufacturer: YAGEO; Tolerance: 0.01; Rated Voltage: 0.125W; Part Number: RC0805FR075K1L; Value: 5.1k; Material: FR-07
R22 = RC0805FR0710ML: Manufacturer: YAGEO; Tolerance: 0.01; Rated Voltage: 0.125W; Part Number: RC0805FR0710ML; Value: 10M; Material: FR-07
SERIAL1 = TH 2.54mm Header 1x4: Positions: 4; Angle: 0; Flange: No; Contact: NA; Part Number: TH 2.54mm Header 1x4; Pitch: 2.54mm; Row Spacing: 2.54mm
STLINK1 = TH 2.54mm Header 2x5: Positions: 10; Angle: 0; Flange: No; Contact: NA; Part Number: TH 2.54mm Header 2x5; Pitch: 2.54mm; Row Spacing: 2.54mm
U6 = STM32F103C8T6: ARM® Cortex®-M3 STM32F1 Microcontroller IC 32-Bit 72MHz 64KB (64K x 8) FLASH; Manufacturer: STMicroelectronics; Part Number: STM32F103C8T6; Digikey Part Number: 497-6063-ND; Digikey Link: https://www.digikey.com/product-detail/en/stmicroelectronics/STM32F103C8T6/497-6063-ND/1646338
U7 = RT9193-33GB: IC REG LINEAR 3.3V 300MA SOT23-5; Manufacturer: Richtek; Part Number: RT9193-33GB; Digikey Part Number: 1028-1014-1-ND; Digikey Link: https://www.digikey.com/products/en?keywords=1028-1014-1-ND
X1 = ABLS-16.000MHZ-B4-T: Manufacturer: Abracon LLC; Load Capacitance: 18pF; ESR: 40R; Part Number: ABLS-16.000MHZ-B4-T; Digikey Part Number: 535-10226-1-ND; Digikey Link: https://www.digikey.com/product-detail/en/abracon-llc/ABLS-16.000MHZ-B4-T/535-10226-1-ND/2184261
X2 = FC-135 32.7680KA-A5: Manufacturer: EPSON; Load Capacitance: 12.5pF; ESR: 70k; Part Number: FC-135 32.7680KA-A5; Value: 32.768kHz; Digikey Part Number: SER4103TR-ND; Digikey Link: https://www.digikey.com/product-detail/en/epson/FC-135-32.7680KA-A5/SER4103TR-ND/5259895

## Sheet Digital Inputs.SchDoc
size A4
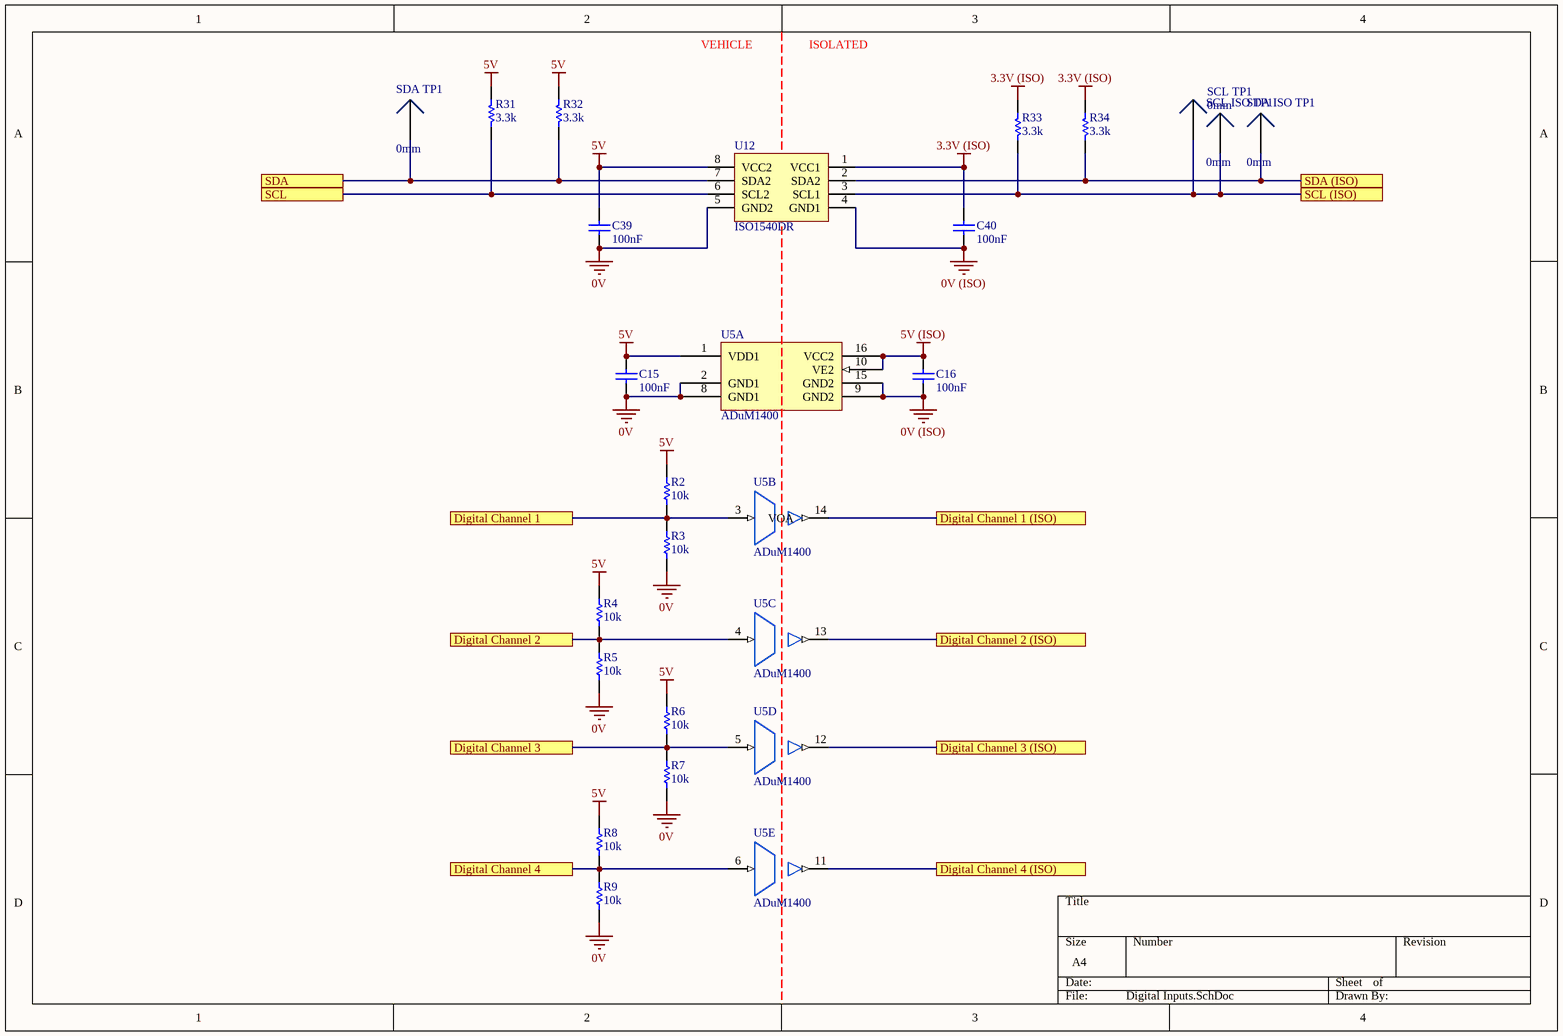
[diagram p7: Digital Inputs.SchDoc]

### Parts
C15  100nF  [0805]
C16  100nF  [0805]
C39  100nF  [0805]
C40  100nF  [0805]
R2  10k  [0805]
R3  10k  [0805]
R4  10k  [0805]
R5  10k  [0805]
R6  10k  [0805]
R7  10k  [0805]
R8  10k  [0805]
R9  10k  [0805]
R31  3.3k  [0805]
R32  3.3k  [0805]
R33  3.3k  [0805]
R34  3.3k  [0805]
SCL_ISO_TP1  0mm  [SMD Test Point]
SCL_TP1  0mm  [SMD Test Point]
SDA_ISO_TP1  0mm  [SMD Test Point]
SDA_TP1  0mm  [SMD Test Point]
U5  ADuM1400  [AD 16-SOIC]  (parts A,B,C,D,E of 5)
U12  ISO1540DR  [TI 8-SOIC]

### Ports
Digital Channel 1, Digital Channel 1 (ISO), Digital Channel 2, Digital Channel 2 (ISO), Digital Channel 3, Digital Channel 3 (ISO), Digital Channel 4, Digital Channel 4 (ISO), SCL, SCL (ISO), SDA, SDA (ISO)

### Nets
0V: C15.1 C39.1 R3.1 R5.1 R7.1 R9.1 U5.2(GND1) U5.8(GND1) U12.5(GND2)
0V (ISO): C16.1 C40.1 U5.9(GND2) U5.15(GND2) U12.4(GND1)
3.3V (ISO): C40.2 R33.2 R34.2 U12.1(VCC1)
5V: C15.2 C39.2 R2.2 R4.2 R6.2 R8.2 R31.2 R32.2 U5.1(VDD1) U12.8(VCC2)
5V (ISO): C16.2 U5.10(VE2) U5.16(VCC2)
Digital 1: R2.1 R3.2 U5.3(VIA) ; port Digital Channel 1
Digital 2: R4.1 R5.2 U5.4(VIB) ; port Digital Channel 2
Digital 3: R6.1 R7.2 U5.5(VIC) ; port Digital Channel 3
Digital 4: R8.1 R9.2 U5.6(VID) ; port Digital Channel 4
NetR19_1: R31.1 U12.6(SCL2) ; port SCL
NetR20_1: R32.1 SDA_TP1.1 U12.7(SDA2) ; port SDA
NetR33_1: R33.1 SCL_ISO_TP1.1 SCL_TP1.1 U12.3(SCL1) ; port SCL (ISO)
NetR34_1: R34.1 SDA_ISO_TP1.1 U12.2(SDA2) ; port SDA (ISO)
NetU5_11: U5.11(VOD) ; port Digital Channel 4 (ISO)
NetU5_12: U5.12(VOC) ; port Digital Channel 3 (ISO)
NetU5_13: U5.13(VOB) ; port Digital Channel 2 (ISO)
NetU5_14: U5.14(VOA) ; port Digital Channel 1 (ISO)

### Notes on the sheet
- VEHICLE
- ISOLATED

### Library data of the parts
C15 C16 C39 C40 = GCM21BR71E104KA37L: as C1 on sheet 4 Channel ADC; Part Number: GCM21BR71E104KA37L; Value: 100nF
R2-R9 = RC0805FR0710KL: as R10 on sheet Input Filter; Part Number: RC0805FR0710KL; Value: 10k; Material: FR-07
R31-R34 = RC0805FR073K3L: Manufacturer: YAGEO; Tolerance: 0.01; Rated Voltage: 0.125W; Part Number: RC0805FR073K3L; Value: 3.3k; Material: FR-07
SCL_ISO_TP1 SCL_TP1 SDA_ISO_TP1 SDA_TP1 = SMD Test Point: as CAN_RX_TP1 on sheet CAN; Part Number: SMD Test Point; Pitch: 0mm; Angle: 0
U5 = ADuM1400: General Purpose Digital Isolator 2500Vrms 4 Channel 1Mbps 25kV/µs CMTI 16-SOIC (0.295", 7.50mm Width); Manufacturer: Analog Devices; Part Number: ADuM1400; Digikey Part Number: ADUM1400WSRWZ-ND; Digikey Link: https://www.digikey.com/product-detail/en/analog-devices-inc/ADUM1400WSRWZ/ADUM1400WSRWZ-ND/1873713
U12 = ISO1540DR: I2C Digital Isolator (Multichannel); Manufacturer: Texas Instruments; Part Number: ISO1540DR; Digikey Part Number: 296-34871-1-ND; Digikey Link: https://www.digikey.com/product-detail/en/texas-instruments/ISO1540DR/296-34871-1-ND/3587214

## Nets that join several sheets
0V: 4 Channel ADC (C1.1 U1.3), U_4 Channel ADC/U_Input Filter (C17_U_Input_Filter4.1 R12_U_Input_Filter4.1), U_4 Channel ADC/U_Input Filter (C17_U_Input_Filter3.1 R12_U_Input_Filter3.1), U_4 Channel ADC/U_Input Filter (C17_U_Input_Filter2.1 R12_U_Input_Filter2.1), U_4 Channel ADC/U_Input Filter (C17_U_Input_Filter1.1 R12_U_Input_Filter1.1), Output Driver (C32.1 C33.1 U8.5), Power Supply (7 pins), Digital Inputs (9 pins)
0V (ISO): CAN (9 pins), Output Driver (C31.1 R24.1 R27.1 U8.4), Power Supply (4.1 C38.1 R30.1 U10.4), Microcontroller (26 pins), Digital Inputs (5 pins)
3.3V (ISO): Microcontroller (19 pins), Digital Inputs (C40.2 R33.2 R34.2 U12.1)
5V: Top Level (P3.1 P3.2), 4 Channel ADC (C1.2 U1.1 U1.8), U_4 Channel ADC/U_Input Filter (R10_U_Input_Filter4.2), U_4 Channel ADC/U_Input Filter (R10_U_Input_Filter3.2), U_4 Channel ADC/U_Input Filter (R10_U_Input_Filter2.2), U_4 Channel ADC/U_Input Filter (R10_U_Input_Filter1.2), Output Driver (C32.2 C33.2 U8.8), Power Supply (5 pins), Digital Inputs (10 pins)
5V (ISO): CAN (6 pins), Output Driver (C31.2 U8.1), Power Supply (2.1 C38.2 D9.A U10.5), Microcontroller (6 pins), Digital Inputs (C16.2 U5.10 U5.16)
CANH: Top Level (CANSEL1.4 CANSEL2.4 CANSEL3.4), CAN (C12.2 CAN_TERM_R1.2 U3.2)
CANL: Top Level (CANSEL1.2 CANSEL2.2 CANSEL3.2), CAN (C11.2 CAN_TERM_R2.1 U3.1)
CANS: Top Level (P1.1), CAN (15 pins)
Digital 1: Top Level (P5.1), Digital Inputs (R2.1 R3.2 U5.3)
Digital 2: Top Level (P5.2), Digital Inputs (R4.1 R5.2 U5.4)
Digital 3: Top Level (P5.3), Digital Inputs (R6.1 R7.2 U5.5)
Digital 4: Top Level (P5.4), Digital Inputs (R8.1 R9.2 U5.6)
Driver 1: Top Level (P2.2), Output Driver (D3.A D4.K Q1.D)
Driver 2: Top Level (P2.4), Output Driver (D5.A D6.K Q2.D)
GLV+: Top Level (Header_1x2.1 P1.12 P2.1 P2.3), Power Supply (F1.1 GLV+_TP1.1)
GLV-: Top Level (Header_1x2.2 P1.11), Power Supply (C34.1 C35.1 GLV-_TP1.1 U11.4)
NetC17_U_Input_Filter1_2: 4 Channel ADC (U1.7), U_4 Channel ADC/U_Input Filter (C17_U_Input_Filter1.2 R10_U_Input_Filter1.1 R11_U_Input_Filter1.2 R12_U_Input_Filter1.2)
NetC17_U_Input_Filter2_2: 4 Channel ADC (U1.6), U_4 Channel ADC/U_Input Filter (C17_U_Input_Filter2.2 R10_U_Input_Filter2.1 R11_U_Input_Filter2.2 R12_U_Input_Filter2.2)
NetC17_U_Input_Filter3_2: 4 Channel ADC (U1.5), U_4 Channel ADC/U_Input Filter (C17_U_Input_Filter3.2 R10_U_Input_Filter3.1 R11_U_Input_Filter3.2 R12_U_Input_Filter3.2)
NetC17_U_Input_Filter4_2: 4 Channel ADC (U1.4), U_4 Channel ADC/U_Input Filter (C17_U_Input_Filter4.2 R10_U_Input_Filter4.1 R11_U_Input_Filter4.2 R12_U_Input_Filter4.2)
NetCAN_RX_TP1_1: CAN (CAN_RX_TP1.1 U2.4), Microcontroller (U6.45)
NetCAN_TX_TP1_1: CAN (CAN_TX_TP1.1 U2.5), Microcontroller (U6.46)
NetR19_1: Microcontroller (R19.1 U6.42), Digital Inputs (R31.1 U12.6)
NetR20_1: Microcontroller (R20.1 U6.43), Digital Inputs (R32.1 SDA_TP1.1 U12.7)
NetR24_2: Output Driver (R24.2 U8.2), Microcontroller (U6.27)
NetR27_2: Output Driver (R27.2 U8.3), Microcontroller (U6.28)
NetR33_1: 4 Channel ADC (U1.10), Digital Inputs (R33.1 SCL_ISO_TP1.1 SCL_TP1.1 U12.3)
NetR34_1: 4 Channel ADC (U1.9), Digital Inputs (R34.1 SDA_ISO_TP1.1 U12.2)
NetU5_11: Microcontroller (U6.26), Digital Inputs (U5.11)
NetU5_12: Microcontroller (U6.25), Digital Inputs (U5.12)
NetU5_13: Microcontroller (U6.22), Digital Inputs (U5.13)
NetU5_14: Microcontroller (U6.21), Digital Inputs (U5.14)
Sensor 1: Top Level (P4.1), U_4 Channel ADC/U_Input Filter (R11_U_Input_Filter4.1)
Sensor 2: Top Level (P4.2), U_4 Channel ADC/U_Input Filter (R11_U_Input_Filter3.1)
Sensor 3: Top Level (P4.3), U_4 Channel ADC/U_Input Filter (R11_U_Input_Filter2.1)
Sensor 4: Top Level (P4.4), U_4 Channel ADC/U_Input Filter (R11_U_Input_Filter1.1)